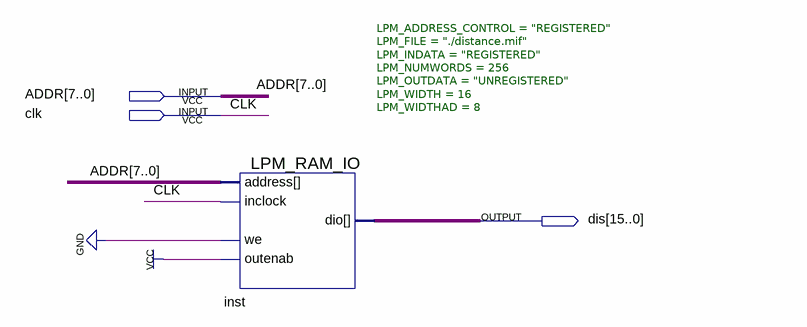
[diagram p0: schematic sheet]
// Quartus schematic distance.bdf as structural Verilog: 1 symbols, 3 pins
module distance (
  input  [7:0] ADDR,
  input  clk,
  output [15:0] dis
);

  LPM_RAM_IO #(.LPM_ADDRESS_CONTROL("REGISTERED"), .LPM_FILE("./distance.mif"), .LPM_INDATA("REGISTERED"), .LPM_NUMWORDS(256), .LPM_OUTDATA("UNREGISTERED"), .LPM_WIDTH(16), .LPM_WIDTHAD(8)) inst (
    .address(ADDR), .inclock(clk), .we(1'b0), .outenab(1'b1), .dio(dis));
endmodule
